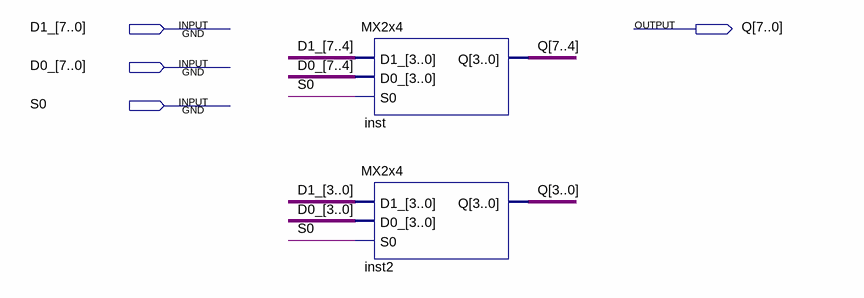
[diagram p0: schematic sheet]
// Quartus schematic MX2x8.bdf as structural Verilog: 2 symbols, 4 pins
module MX2x8 (
  input  [7:0] D1_,
  input  [7:0] D0_,
  input  S0,
  output [7:0] Q
);

  MX2x4 inst (.D1_(D1_[7:4]), .D0_(D0_[7:4]), .S0(S0), .Q(Q[7:4]));
  MX2x4 inst2 (.D1_(D1_[3:0]), .D0_(D0_[3:0]), .S0(S0), .Q(Q[3:0]));
endmodule
